# EAGLE design HV MPPC (EAGLE 8.2.2)
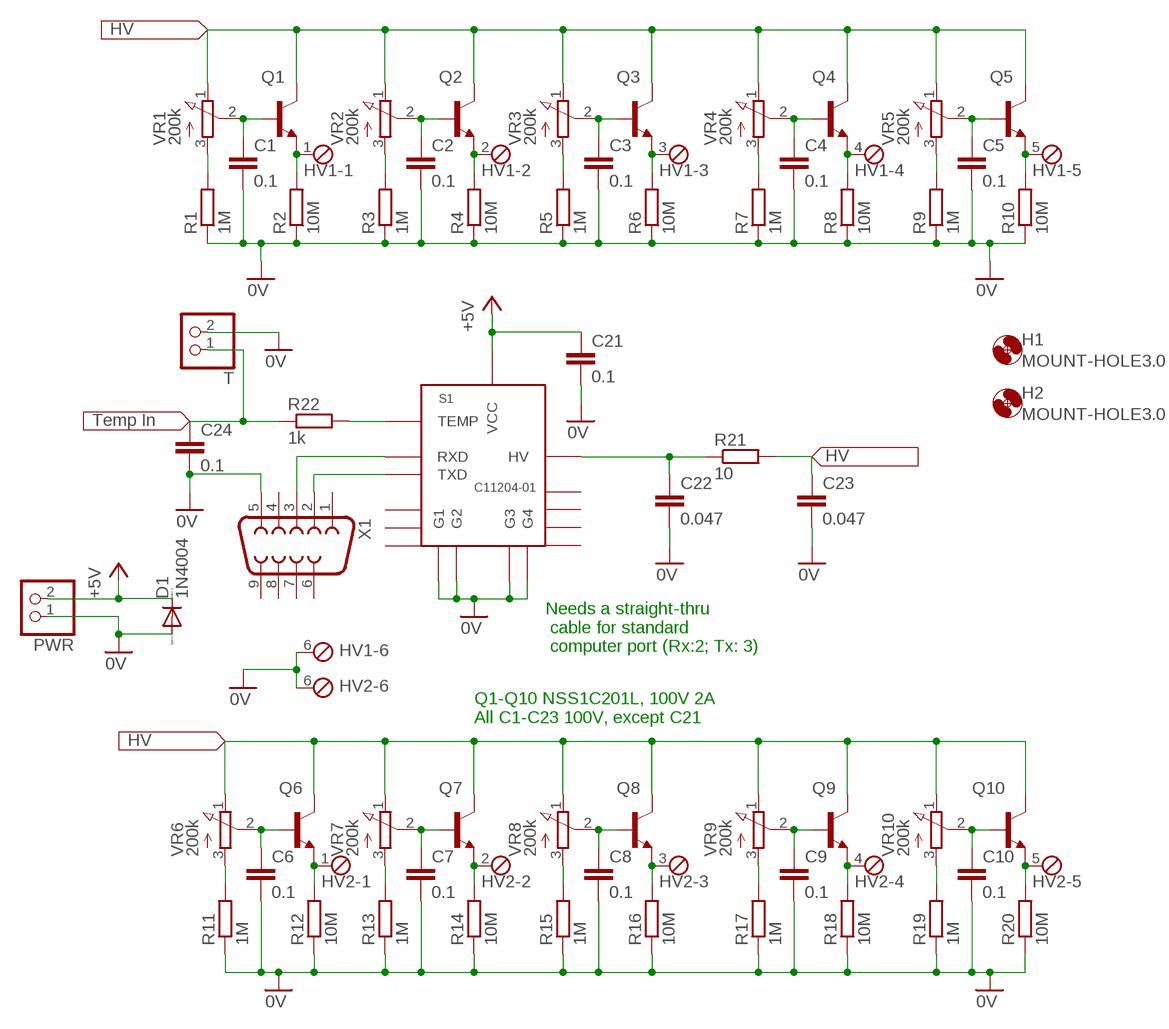
[diagram p0: schematic, sheet 1]

## Parts
C1  0.1  C-EUC0805  [C0805]
C2  0.1  C-EUC0805  [C0805]
C3  0.1  C-EUC0805  [C0805]
C4  0.1  C-EUC0805  [C0805]
C5  0.1  C-EUC0805  [C0805]
C6  0.1  C-EUC0805  [C0805]
C7  0.1  C-EUC0805  [C0805]
C8  0.1  C-EUC0805  [C0805]
C9  0.1  C-EUC0805  [C0805]
C10  0.1  C-EUC0805  [C0805]
C21  0.1  C-EUC0805  [C0805]
C22  0.047  C-EUC0805  [C0805]
C23  0.047  C-EUC0805  [C0805]
C24  0.1  C-EUC0805  [C0805]
D1  1N4004  [DO41-10]
H1  MOUNT-HOLE3.0  [3,0]
H2  MOUNT-HOLE3.0  [3,0]
HV1  MPT6  [6POL254]
HV2  MPT6  [6POL254]
PWR  PINHD-1X2  [1X02]
Q1  NSS1C201L  [SOT23]
Q2  NSS1C201L  [SOT23]
Q3  NSS1C201L  [SOT23]
Q4  NSS1C201L  [SOT23]
Q5  NSS1C201L  [SOT23]
Q6  NSS1C201L  [SOT23]
Q7  NSS1C201L  [SOT23]
Q8  NSS1C201L  [SOT23]
Q9  NSS1C201L  [SOT23]
Q10  NSS1C201L  [SOT23]
R1  1M  R-EU_R0805  [R0805]
R2  10M  R-EU_R0805  [R0805]
R3  1M  R-EU_R0805  [R0805]
R4  10M  R-EU_R0805  [R0805]
R5  1M  R-EU_R0805  [R0805]
R6  10M  R-EU_R0805  [R0805]
R7  1M  R-EU_R0805  [R0805]
R8  10M  R-EU_R0805  [R0805]
R9  1M  R-EU_R0805  [R0805]
R10  10M  R-EU_R0805  [R0805]
R11  1M  R-EU_R0805  [R0805]
R12  10M  R-EU_R0805  [R0805]
R13  1M  R-EU_R0805  [R0805]
R14  10M  R-EU_R0805  [R0805]
R15  1M  R-EU_R0805  [R0805]
R16  10M  R-EU_R0805  [R0805]
R17  1M  R-EU_R0805  [R0805]
R18  10M  R-EU_R0805  [R0805]
R19  1M  R-EU_R0805  [R0805]
R20  10M  R-EU_R0805  [R0805]
R21  10  R-EU_R0805  [R0805]
R22  1k  R-EU_R0805  [R0805]
S1  C11204-01  [C11204-01]
T  PINHD-1X2  [1X02]
VR1  200k  BOURNS3314  [3314G]
VR2  200k  BOURNS3314  [3314G]
VR3  200k  BOURNS3314  [3314G]
VR4  200k  BOURNS3314  [3314G]
VR5  200k  BOURNS3314  [3314G]
VR6  200k  BOURNS3314  [3314G]
VR7  200k  BOURNS3314  [3314G]
VR8  200k  BOURNS3314  [3314G]
VR9  200k  BOURNS3314  [3314G]
VR10  200k  BOURNS3314  [3314G]
X1  F09HP  [F09HP]

## Nets
0V: C1.2 C2.2 C3.2 C4.2 C5.2 C6.2 C7.2 C8.2 C9.2 C10.2 C21.2 C22.2 C23.2 C24.2 D1.A HV1.6 HV2.6 PWR.1 R1.1 R2.1 R3.1 R4.1 R5.1 R6.1 R7.1 R8.1 R9.1 R10.1 R11.1 R12.1 R13.1 R14.1 R15.1 R16.1 R17.1 R18.1 R19.1 R20.1 S1.P$2(G1) S1.P$5(G2) S1.P$8(G3) S1.P$15(G4) T.2 X1.5
+5V: C21.1 D1.C PWR.2 S1.P$1(VCC)
HV: C22.1 R21.1 S1.P$10(HV)
HVOUT: C23.1 Q1.3(C) Q2.3(C) Q3.3(C) Q4.3(C) Q5.3(C) Q6.3(C) Q7.3(C) Q8.3(C) Q9.3(C) Q10.3(C) R21.2 VR1.1(E) VR2.1(E) VR3.1(E) VR4.1(E) VR5.1(E) VR6.1(E) VR7.1(E) VR8.1(E) VR9.1(E) VR10.1(E)
N$3: C1.1 Q1.1(B) VR1.2(S)
N$4: C24.1 R22.1 T.1
N$5: R22.2 S1.P$16(TEMP)
N$6: R1.2 VR1.3(A)
N$7: HV1.1 Q1.2(E) R2.2
N$8: R3.2 VR2.3(A)
N$9: HV1.2 Q2.2(E) R4.2
N$10: R5.2 VR3.3(A)
N$11: HV1.3 Q3.2(E) R6.2
N$12: R7.2 VR4.3(A)
N$13: HV1.4 Q4.2(E) R8.2
N$14: R9.2 VR5.3(A)
N$15: HV1.5 Q5.2(E) R10.2
N$16: C2.1 Q2.1(B) VR2.2(S)
N$17: C3.1 Q3.1(B) VR3.2(S)
N$18: C4.1 Q4.1(B) VR4.2(S)
N$19: C5.1 Q5.1(B) VR5.2(S)
N$20: C6.1 Q6.1(B) VR6.2(S)
N$21: C7.1 Q7.1(B) VR7.2(S)
N$22: C8.1 Q8.1(B) VR8.2(S)
N$23: C9.1 Q9.1(B) VR9.2(S)
N$24: C10.1 Q10.1(B) VR10.2(S)
N$25: R11.2 VR6.3(A)
N$26: HV2.1 Q6.2(E) R12.2
N$27: R13.2 VR7.3(A)
N$28: HV2.2 Q7.2(E) R14.2
N$29: R15.2 VR8.3(A)
N$30: HV2.3 Q8.2(E) R16.2
N$31: R17.2 VR9.3(A)
N$32: R19.2 VR10.3(A)
N$33: HV2.5 Q10.2(E) R20.2
N$35: HV2.4 Q9.2(E) R18.2
RX: S1.P$3(RXD) X1.3
TX: S1.P$4(TXD) X1.2
Unconnected: S1.P$6 S1.P$7 S1.P$9 S1.P$11 S1.P$12 S1.P$13 S1.P$14 X1.1 X1.4 X1.6 X1.7 X1.8 X1.9

## Notes on the sheet
- Needs a straight-thru
   cable for standard
   computer port (Rx:2; Tx: 3)
- Q1-Q10 NSS1C201L, 100V 2A
  All C1-C23 100V, except C21

## Library data of the parts
C1-C10 C21-C24 = rcl:C-EU: CAPACITOR, European symbol
D1 = diode:1N4004: DIODE general purpose rectifier, 1 A
H1 H2 = holes:MOUNT-HOLE: MOUNTING HOLE with drill center marker
HV1 HV2 = con-phoenix-254:MPT6: PHOENIX CONNECTOR; OC_FARNELL: unknown; OC_NEWARK: unknown
PWR T = pinhead:PINHD-1X2: PIN HEADER
Q1-Q10 = custom_parts:NSS1C201L: OnSemi 100 VOLTS, 3.0A peak, 2A cont. NPN LOW VCE(sat) TRANSISTOR
R1-R22 = rcl:R-EU_: RESISTOR, European symbol
S1 = custom_parts:C11204-01: Hamamatsu C11204-01 HV supply for MPPC
VR1-VR10 = custom_parts:BOURNS3314: Bourns 3314 4x4mm pot
X1 = con-subd:F09: SUB-D; OC_FARNELL: unknown; OC_NEWARK: unknown

## Board
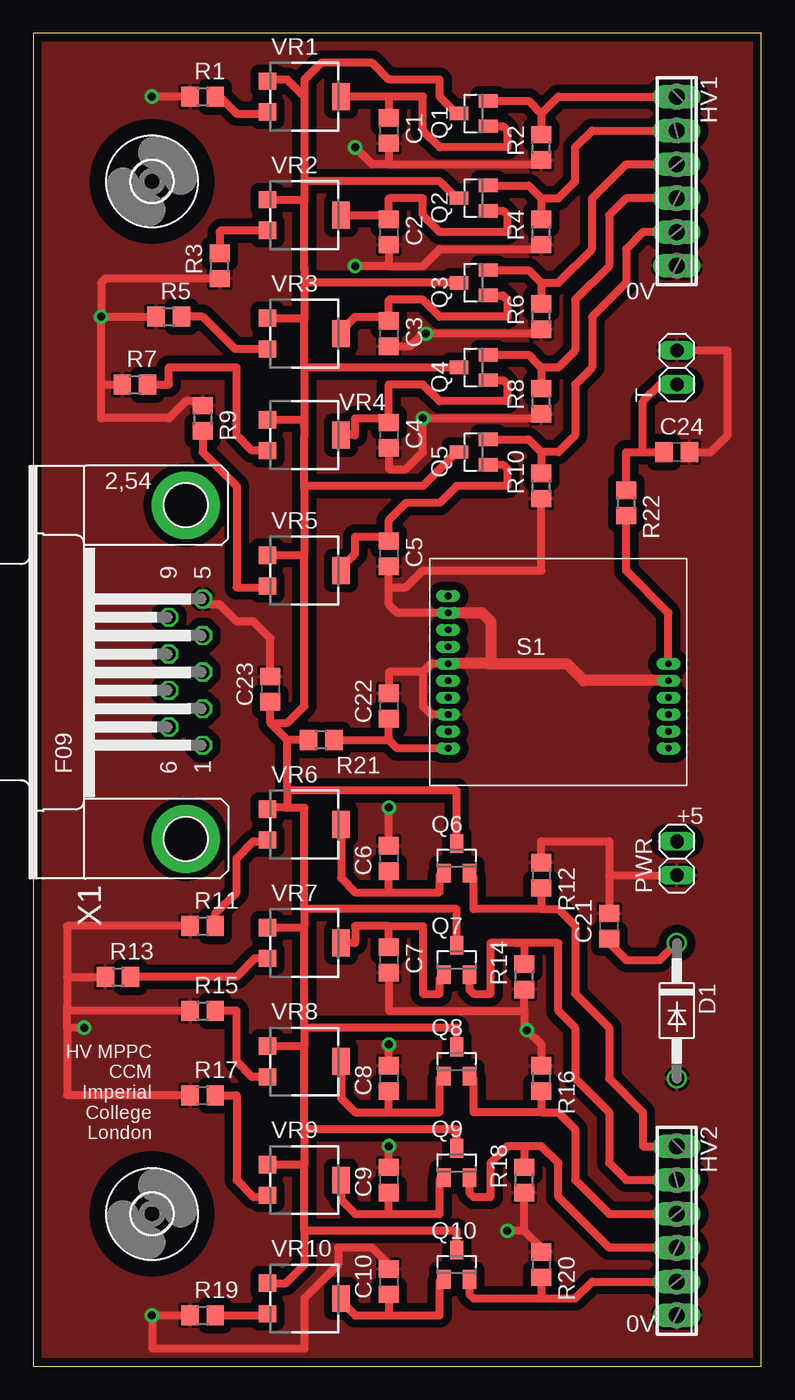
[diagram p1: board, top side]
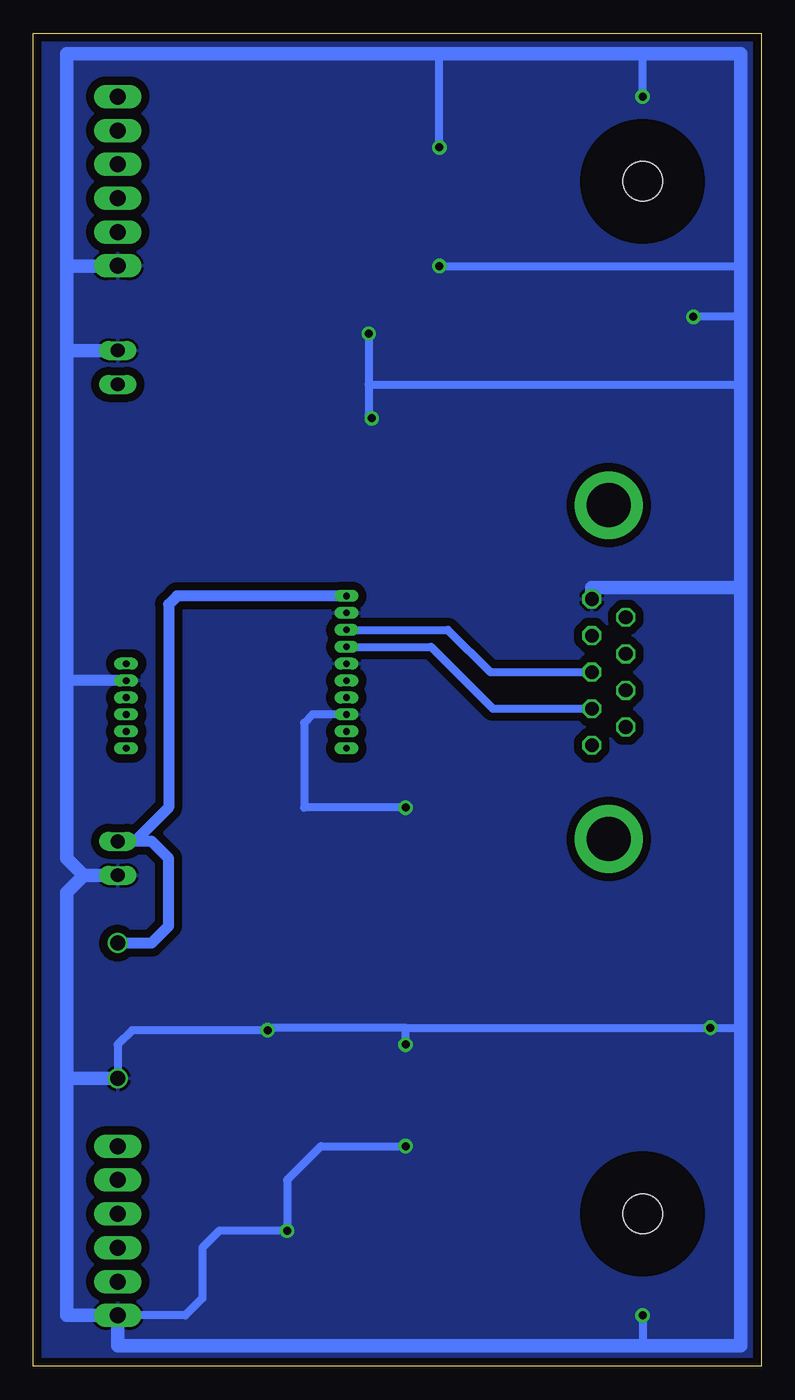
[diagram p2: board, bottom side, seen from below]

Size 54.59 x 100 mm. Coordinates in mm from the lower left corner, seen from the top.
Outline: 0,0 54.59,0 54.59,100 0,100 0,0
Copper layers (1*16): Top 0.035mm / dielectric 1.5mm / Bottom 0.035mm
Design rules "PCB-POOL Standard": minimum track width 0.15mm, minimum drill 0.3mm, track to track 0.15mm, track to pad 0.15mm, pad to pad 0.15mm, via to via 0.15mm, smd to smd 0.15mm, copper to edge 0.3mm, drill to drill 0.2mm, minimum pad ring 0.2mm, minimum via ring 0.15mm, stop-mask expansion 0.075mm, vias tented up to drill 0mil, thermal gap 0.2mm

### Footprints (pad centres in the part's own frame; a part is rotated, then mirrored left to right if it is on the bottom)
C0805 = smd 1.3 x 1.5: 1 -0.95,0; 2 0.95,0
DO41-10 = drill 1.118: A 5.08,0; C -5.08,0
3,0 = hole 3: 0,0
6POL254 = drill 1.2 pad 1.778 long: 1 -6.35,0; 2 -3.81,0; 3 -1.27,0; 4 1.27,0; 5 3.81,0; 6 6.35,0
1X02 = drill 1.016 long: 1 -1.27,0; 2 1.27,0
SOT23 = smd 1 x 1.4: 1 -0.95,-1.1; 2 0.95,-1.1; 3 0,1.1
R0805 = smd 1.3 x 1.5: 1 -0.95,0; 2 0.95,0
C11204-01 = drill 0.5 long: P$1 -8.255,5.715; P$2 -8.255,4.445; P$3 -8.255,3.175; P$4 -8.255,1.905; P$5 -8.255,0.635; P$6 -8.255,-0.635; P$7 -8.255,-1.905; P$8 -8.255,-3.175; P$9 -8.255,-4.445; P$10 -8.255,-5.715; P$11 8.255,-5.715; P$12 8.255,-4.445; P$13 8.255,-3.175; P$14 8.255,-1.905; P$15 8.255,-0.635; P$16 8.255,0.635
3314G = smd 1.295 x 1.295: 1 -2.756,1.156; 3 -2.756,-1.156 | smd 1.295 x 2.007: 2 2.756,0
F09HP = drill 1.016 octagon: 1 -5.486,-1.27; 2 -2.743,-1.27; 3 0,-1.27; 4 2.743,-1.27; 5 5.486,-1.27; 6 -4.115,1.27; 7 -1.372,1.27; 8 1.372,1.27; 9 4.115,1.27 | drill 3.302 pad 5.08: G1 -12.522,0; G2 12.522,0

### Placement (x,y rotation side)
C1  26.67,92.71 270 top
C2  26.67,85.09 270 top
C3  26.67,77.47 270 top
C4  26.67,69.85 270 top
C5  26.67,60.96 270 top
C6  26.67,38.1 90 top
C7  26.67,30.48 270 top
C8  26.67,21.59 90 top
C9  26.67,13.97 90 top
C10  26.67,6.35 90 top
C21  43.18,33.02 90 top
C22  26.67,49.53 90 top
C23  17.78,50.8 90 top
C24  48.26,68.58 0 top
D1  48.26,26.67 270 top
H1  8.89,11.43 0 top
H2  8.89,88.9 0 top
HV1  48.26,88.9 270 top
HV2  48.26,10.16 270 top
PWR  48.26,38.1 90 top
Q1  33.02,93.98 90 top
Q2  33.02,87.63 90 top
Q3  33.02,81.28 90 top
Q4  33.02,74.93 90 top
Q5  33.02,68.58 90 top
Q6  31.75,38.1 0 top
Q7  31.75,30.48 0 top
Q8  31.75,22.86 0 top
Q9  31.75,15.24 0 top
Q10  31.75,7.62 0 top
R1  12.7,95.25 0 top
R2  38.1,91.44 90 top
R3  13.97,82.55 90 top
R4  38.1,85.09 90 top
R5  10.16,78.74 0 top
R6  38.1,78.74 90 top
R7  7.62,73.66 0 top
R8  38.1,72.39 90 top
R9  12.7,71.12 270 top
R10  38.1,66.04 90 top
R11  12.7,33.02 0 top
R12  38.1,36.83 270 top
R13  6.35,29.21 0 top
R14  36.83,29.21 90 top
R15  12.7,26.67 0 top
R16  38.1,21.59 270 top
R17  12.7,20.32 0 top
R18  36.83,13.97 90 top
R19  12.7,3.81 0 top
R20  38.1,7.62 270 top
R21  21.59,46.99 180 top
R22  44.45,64.77 270 top
S1  39.37,52.07 0 top
T  48.26,74.93 90 top
VR1  20.32,95.25 0 top
VR2  20.32,86.36 0 top
VR3  20.32,77.47 0 top
VR4  20.32,69.85 0 top
VR5  20.32,59.69 0 top
VR6  20.32,40.64 0 top
VR7  20.32,31.75 0 top
VR8  20.32,22.86 0 top
VR9  20.32,13.97 0 top
VR10  20.32,5.08 0 top
X1  11.43,52.07 90 top

### Tracks (layer width: path | path; a pad name or v marks a point on that pad's centre or on a via)
0V  (via drill 0.6)
  Top 0.61: S1.P$8 29.84,48.9 29.21,49.53 29.21,52.07 | 29.21,52.07 26.67,52.07 C22.2 | S1.P$5 29.84,52.7 29.21,52.07 | S1.P$2 27.3,56.52 26.67,57.15 26.67,58.42 | 26.67,58.42 C5.2 | C24.2 50.8,68.58 52.07,69.85 52.07,76.2 T.2 | R1.1 v8.89,95.25 | v5.08,78.74 R5.1 | 5.08,73.66 R7.1 | 5.08,73.66 v5.08,78.74 | R3.1 5.4,81.6 5.08,81.28 v5.08,78.74 | R9.1 12.7,72.39 11.43,72.39 10.16,71.12 5.08,71.12 5.08,73.66 | 26.67,58.42 27.94,58.42 29.21,59.69 38.1,59.69 R10.1 | C4.2 26.67,67.31 27.94,67.31 29.21,68.58 v29.21,71.12 37.78,71.12 R8.1 | C3.2 28.26,76.52 29.21,77.47 v29.44,77.47 37.78,77.47 R6.1 | C2.2 26.67,82.55 | 26.67,82.55 29.21,82.55 30.48,83.82 37.78,83.82 R4.1 | C1.2 26.67,90.17 | R2.1 37.78,90.17 26.67,90.17 | 26.67,82.55 v24.13,82.55 | C23.2 17.78,54.61 16.51,55.88 15.24,55.88 13.97,57.15 13.11,57.15 X1.5 | R19.1 v8.89,3.81 8.94,3.76 8.94,1.32 20.32,1.32 20.32,5.08 22.86,7.62 22.86,8.89 25.4,8.89 26.67,7.62 C10.2 | 36.83,26.66 R14.1 | 36.83,26.66 36.83,25.4 v37.02,25.21 38.1,24.13 R16.1 | C7.2 26.67,26.67 36.82,26.67 36.83,26.66 | C8.2 v26.67,24.13 | R20.1 38.1,8.89 36.83,10.16 | 36.83,10.16 R18.1 | C9.2 v26.67,16.51 | 36.83,10.16 v35.56,10.16 | R17.1 2.54,20.32 2.54,25.34 | 2.54,25.34 2.54,26.97 | 2.54,29.21 2.54,26.97 | 2.54,29.21 R13.1 | R15.1 2.84,26.67 2.54,26.97 | R11.1 2.54,33.02 2.54,29.21 | v3.81,25.4 2.6,25.4 2.54,25.34 | 43.18,36.83 PWR.1 | 43.18,36.83 C21.2 | R12.1 38.1,39.37 43.18,39.37 43.18,36.83 | 26.67,90.17 25.4,90.17 v24.13,91.44 | C6.2 v26.67,41.91
  Top 0.813: 34.12,52.7 40.01,52.7 41.27,51.44 S1.P$15 | 34.12,52.7 S1.P$5 | S1.P$2 33.66,56.52 34.29,55.88 34.29,52.88 34.12,52.7
  Bottom 0.61: v8.89,95.25 8.89,98.12 9.25,98.48 | 1.52,78.74 v5.08,78.74 | v24.13,82.55 1.74,82.55 1.52,82.77 | v29.44,77.47 29.44,73.66 | 29.44,73.66 29.44,71.35 v29.21,71.12 | 29.44,73.66 1.68,73.66 1.52,73.81 | v8.89,3.81 8.89,1.82 8.59,1.52 | D1.A 48.26,24.13 47.18,25.21 v37.02,25.21 36.83,25.4 26.67,25.4 | v26.67,24.13 26.67,25.4 | v26.67,16.51 33.02,16.51 35.56,13.97 v35.56,10.16 40.64,10.16 41.91,8.89 41.91,5.08 43.18,3.81 HV2.6 | 26.67,25.4 v3.81,25.4 1.75,25.4 1.52,25.63 | v24.13,91.44 24.13,98.21 23.86,98.48 | v26.67,41.91 34.29,41.91 34.29,48.26 33.66,48.9 S1.P$8
  Bottom 0.813: S1.P$15 51.9,51.44 52.07,51.6
  Bottom 1.016: PWR.1 50.8,36.83 | 50.8,36.83 52.07,35.56 52.07,21.59 | D1.A 52.07,21.59 | 52.07,21.59 52.07,3.81 HV2.6 48.26,1.52 8.59,1.52 1.52,1.52 1.52,25.63 1.52,58.42 | 50.8,36.83 52.07,38.1 52.07,51.6 52.07,75.97 | 52.07,82.55 HV1.6 | 52.07,75.97 52.07,82.55 | T.2 51.84,76.2 52.07,75.97 | X1.5 12.7,58.42 1.53,58.42 1.52,58.42 | 52.07,82.55 52.07,98.48 23.86,98.48 9.25,98.48 1.52,98.48 1.52,82.77 1.52,78.74 1.52,73.81 1.52,58.42
  pour Top (isolate 0.61): 0,0 0,100.33 53.34,100.33 54.61,99.06 54.61,0
  pour Bottom (isolate 0.61): 0,0 0,100.33 54.61,100.33 54.61,0
+5V
  Top 0.61: C21.1 43.18,31.75 44.45,30.48 46.99,30.48 D1.C
  Bottom 0.813: S1.P$1 43.81,57.78 44.45,57.15 44.45,41.91 46.99,39.37 PWR.2 45.72,39.37 44.45,38.1 44.45,33.02 45.72,31.75 D1.C
HV
  Top 0.61: S1.P$10 27.3,46.35 26.67,46.99 26.67,47.15 | 26.67,47.15 C22.1 | R21.1 26.51,46.99 26.67,47.15
HVOUT
  Top 0.61: R21.2 19.05,46.99 | 19.05,46.99 17.78,48.26 | 17.78,48.26 C23.1 | VR10.1 18.94,6.24 20.32,7.62 20.32,10.17 | 20.32,25.53 20.32,24.07 | 20.32,25.53 20.32,33.05 | 20.32,17.78 20.32,15.14 | 20.32,17.78 20.32,24.07 | 20.32,10.17 20.32,15.14 | 20.32,34.15 20.32,33.05 | 20.32,34.15 20.32,41.91 18.95,41.91 | 18.95,41.91 17.68,41.91 VR6.1 | VR7.1 20.18,32.91 20.32,33.05 | VR8.1 20.27,24.02 20.32,24.07 | VR9.1 20.3,15.13 20.32,15.14 | 19.05,43.33 19.05,46.99 | 19.05,43.33 19.05,42.01 18.95,41.91 | Q7.3 31.75,34.29 20.46,34.29 20.32,34.15 | Q6.3 31.75,43.18 19.2,43.18 19.05,43.33 | Q8.3 31.75,25.4 20.45,25.4 20.32,25.53 | VR5.1 20.21,60.85 20.32,60.96 | 20.32,82.44 20.32,78.52 | 20.32,82.44 20.32,87.4 | 20.32,74.97 20.32,69.78 | 20.32,74.97 20.32,78.52 | 20.32,65.81 20.32,69.78 | 20.32,65.81 20.32,60.96 | 20.32,88.81 20.32,87.4 | 20.32,95.25 20.32,88.81 | 20.32,95.25 19.05,96.52 17.68,96.52 VR1.1 | VR2.1 20.2,87.52 20.32,87.4 | VR3.1 20.21,78.63 20.32,78.52 | VR4.1 20.28,71.01 20.32,69.78 | Q2.3 31.75,87.63 30.48,88.9 20.41,88.9 20.32,88.81 | Q3.3 20.43,81.28 20.32,82.44 | Q4.3 20.36,74.93 20.32,74.97 | Q5.3 31.75,68.58 29.21,66.04 20.55,66.04 20.32,65.81 | Q1.3 31.75,93.98 30.48,95.25 30.48,96.52 26.67,96.52 25.4,97.79 21.59,97.79 20.32,96.52 20.32,95.25 | 17.78,48.26 19.05,48.26 20.32,49.53 20.32,60.96 | Q9.3 31.75,17.78 20.32,17.78 | Q10.3 31.75,10.16 20.33,10.16 20.32,10.17
N$3
  Top 0.61: Q1.1 35.24,93.03 35.56,92.71 35.56,91.44 30.48,91.44 29.21,92.71 29.21,95.25 26.67,95.25 | 26.67,95.25 C1.1 | 26.67,95.25 VR1.2
N$4
  Top 0.61: T.1 46.99,73.66 45.72,72.39 45.72,68.58 | 45.72,68.58 C24.1 | R22.1 44.45,68.58 45.72,68.58
N$5
  Top 0.61: S1.P$16 47.62,56.52 44.45,59.69 R22.2
N$6
  Top 0.61: R1.2 13.97,95.25 15.24,93.98 17.45,93.98 VR1.3
N$7
  Top 0.61: Q1.2 37.15,94.93 38.1,93.98 | 38.1,93.98 R2.2 | 38.1,93.98 39.37,95.25 HV1.1
N$8
  Top 0.61: VR2.3 14.08,85.2 13.97,85.09 R3.2
N$9
  Top 0.61: Q2.2 37.15,88.58 38.1,87.63 | 38.1,87.63 R4.2 | 38.1,87.63 39.37,87.63 40.64,88.9 40.64,91.44 41.91,92.71 HV1.2
N$10
  Top 0.61: VR3.3 15.13,76.31 12.7,78.74 R5.2
N$11
  Top 0.61: Q3.2 37.15,82.23 38.1,81.28 | 38.1,81.28 R6.2 | 38.1,81.28 39.37,81.28 41.91,83.82 41.91,87.63 44.45,90.17 HV1.3
N$12
  Top 0.61: R7.2 10.16,73.66 10.16,74.93 15.24,74.93 15.24,69.85 16.4,68.69 VR4.3 17.45,68.58
N$13
  Top 0.61: Q4.2 37.15,75.88 37.91,75.12 | 37.91,75.12 38.1,74.93 | 38.1,74.93 R8.2 | HV1.4 44.45,87.63 43.18,86.36 43.18,82.55 40.64,80.01 40.64,76.2 39.37,74.93 38.1,74.93 | 38.1,74.93 37.91,75.12
N$14
  Top 0.61: R9.2 12.7,68.58 15.24,66.04 15.24,58.42 17.45,58.42 VR5.3
N$15
  Top 0.61: 38.1,68.58 R10.2 | Q5.2 37.15,69.53 38.1,68.58 | HV1.5 45.72,85.09 44.45,83.82 44.45,81.28 41.91,78.74 41.91,74.93 40.64,73.66 40.64,69.85 39.37,68.58 38.1,68.58
N$16
  Top 0.61: Q2.1 35.24,86.68 35.56,86.36 35.56,85.09 30.48,85.09 29.21,86.36 29.21,87.63 26.67,87.63 26.67,86.4 | 26.67,86.4 C2.1 | VR2.2 26.63,86.36 26.67,86.4
N$17
  Top 0.61: Q3.1 35.24,80.33 35.56,80.01 35.56,78.74 30.48,78.74 29.21,80.01 26.67,80.01 C3.1 26.35,78.74 24.13,78.74 23.08,77.69 VR3.2
N$18
  Top 0.61: Q4.1 35.24,73.98 35.56,73.66 35.56,72.39 30.48,72.39 29.21,73.66 26.67,73.66 26.67,70.96 | 26.67,70.96 C4.1 | VR4.2 23.08,70.07 24.13,69.85 24.13,71.12 26.51,71.12 26.67,70.96
N$19
  Top 0.61: Q5.1 35.24,67.63 35.56,67.31 35.56,66.04 31.75,66.04 30.48,64.77 27.94,64.77 26.67,63.5 C5.1 26.35,62.23 24.13,62.23 24.13,60.96 23.08,59.91 VR5.2
N$20
  Top 0.61: VR6.2 23.08,36.61 24.13,35.56 26.67,35.56 | 26.67,35.56 C6.1 | 26.67,35.56 30.48,35.56 30.48,36.83 30.63,36.83 Q6.1
N$21
  Top 0.61: C7.1 26.67,33.02 | 26.67,33.02 24.13,33.02 24.13,31.75 VR7.2 | VR7.2 22.86,31.75 VR7.2 | 26.67,33.02 29.21,33.02 29.21,27.94 30.48,27.94 30.48,29.06 Q7.1
N$22
  Top 0.61: VR8.2 23.08,20.1 24.13,19.05 26.67,19.05 | 26.67,19.05 C8.1 | 26.67,19.05 30.48,19.05 30.48,21.59 30.63,21.59 Q8.1
N$23
  Top 0.61: VR9.2 23.08,12.48 24.13,11.43 26.67,11.43 | 26.67,11.43 C9.1 | 26.67,11.43 30.48,11.43 30.48,13.97 30.63,13.97 Q9.1
N$24
  Top 0.61: C10.1 26.67,3.81 26.79,3.81 | 26.79,3.81 30.48,3.81 30.48,6.35 30.63,6.35 Q10.1 | VR10.2 23.08,4.86 24.13,3.81 26.79,3.81
N$25
  Top 0.61: R11.2 13.65,33.97 15.24,35.56 15.24,38.1 16.51,39.37 17.45,39.37 VR6.3
N$26
  Top 0.61: R12.2 38.1,34.29 | 38.1,34.29 33.02,34.29 33.02,36.68 Q6.2 | 38.1,34.29 39.37,34.29 40.64,33.02 40.64,27.94 43.18,25.4 43.18,21.59 45.72,19.05 45.72,16.51 HV2.1
N$27
  Top 0.61: VR7.3 16.62,30.59 15.24,29.21 R13.2
N$28
  Top 0.61: HV2.2 44.45,13.97 43.18,15.24 43.18,19.05 40.64,21.59 40.64,25.4 39.37,26.67 39.37,31.75 36.18,31.75 | Q7.2 32.7,28.26 33.02,27.94 34.29,27.94 34.29,31.75 36.18,31.75 | 36.18,31.75 36.83,31.75 R14.2
N$29
  Top 0.61: VR8.3 16.4,21.7 15.24,22.86 15.24,26.67 R15.2
N$30
  Top 0.61: R16.2 38.1,19.05 | 38.1,19.05 33.02,19.05 33.02,21.59 32.87,21.59 Q8.2 | 38.1,19.05 39.37,19.05 40.64,17.78 40.64,13.97 43.18,11.43 HV2.3
N$31
  Top 0.61: R17.2 15.24,20.32 15.24,13.97 16.51,12.7 17.45,12.7 VR9.3
N$32
  Top 0.61: R19.2 17.45,3.81 VR10.3
N$33
  Top 0.61: R20.2 38.1,5.08 38.43,5.08 | 38.43,5.08 40.64,5.08 41.91,6.35 HV2.5 | Q10.2 32.7,5.4 33.02,5.08 38.43,5.08
N$35
  Top 0.61: 32.87,13.97 Q9.2 32.7,13.02 33.02,12.7 34.29,12.7 34.29,15.24 35.56,16.51 36.83,16.51 | HV2.4 43.18,8.89 39.37,12.7 39.37,15.24 38.1,16.51 36.83,16.51 | 36.83,16.51 R18.2
RX
  Bottom 0.61: S1.P$3 23.5,55.24 20.32,52.07 X1.3
TX
  Bottom 0.61: X1.2 20.12,49.33 24.77,53.98 S1.P$4

### Text on the board
tPlace: 0V | +5 | 0V
tNames: HV MPPC / CCM / Imperial / College / London